# Altium schematic sheet [04] - DOC REVISION HISTORY.SchDoc
size A3; DocumentNumber: 4; SheetNumber: 4; SheetTotal: 4; Organization: Altium Limited; Address1: L3, 12a Rodborough Rd; Address2: Frenchs Forest; Address3: NSW; Address4: Australia 2086
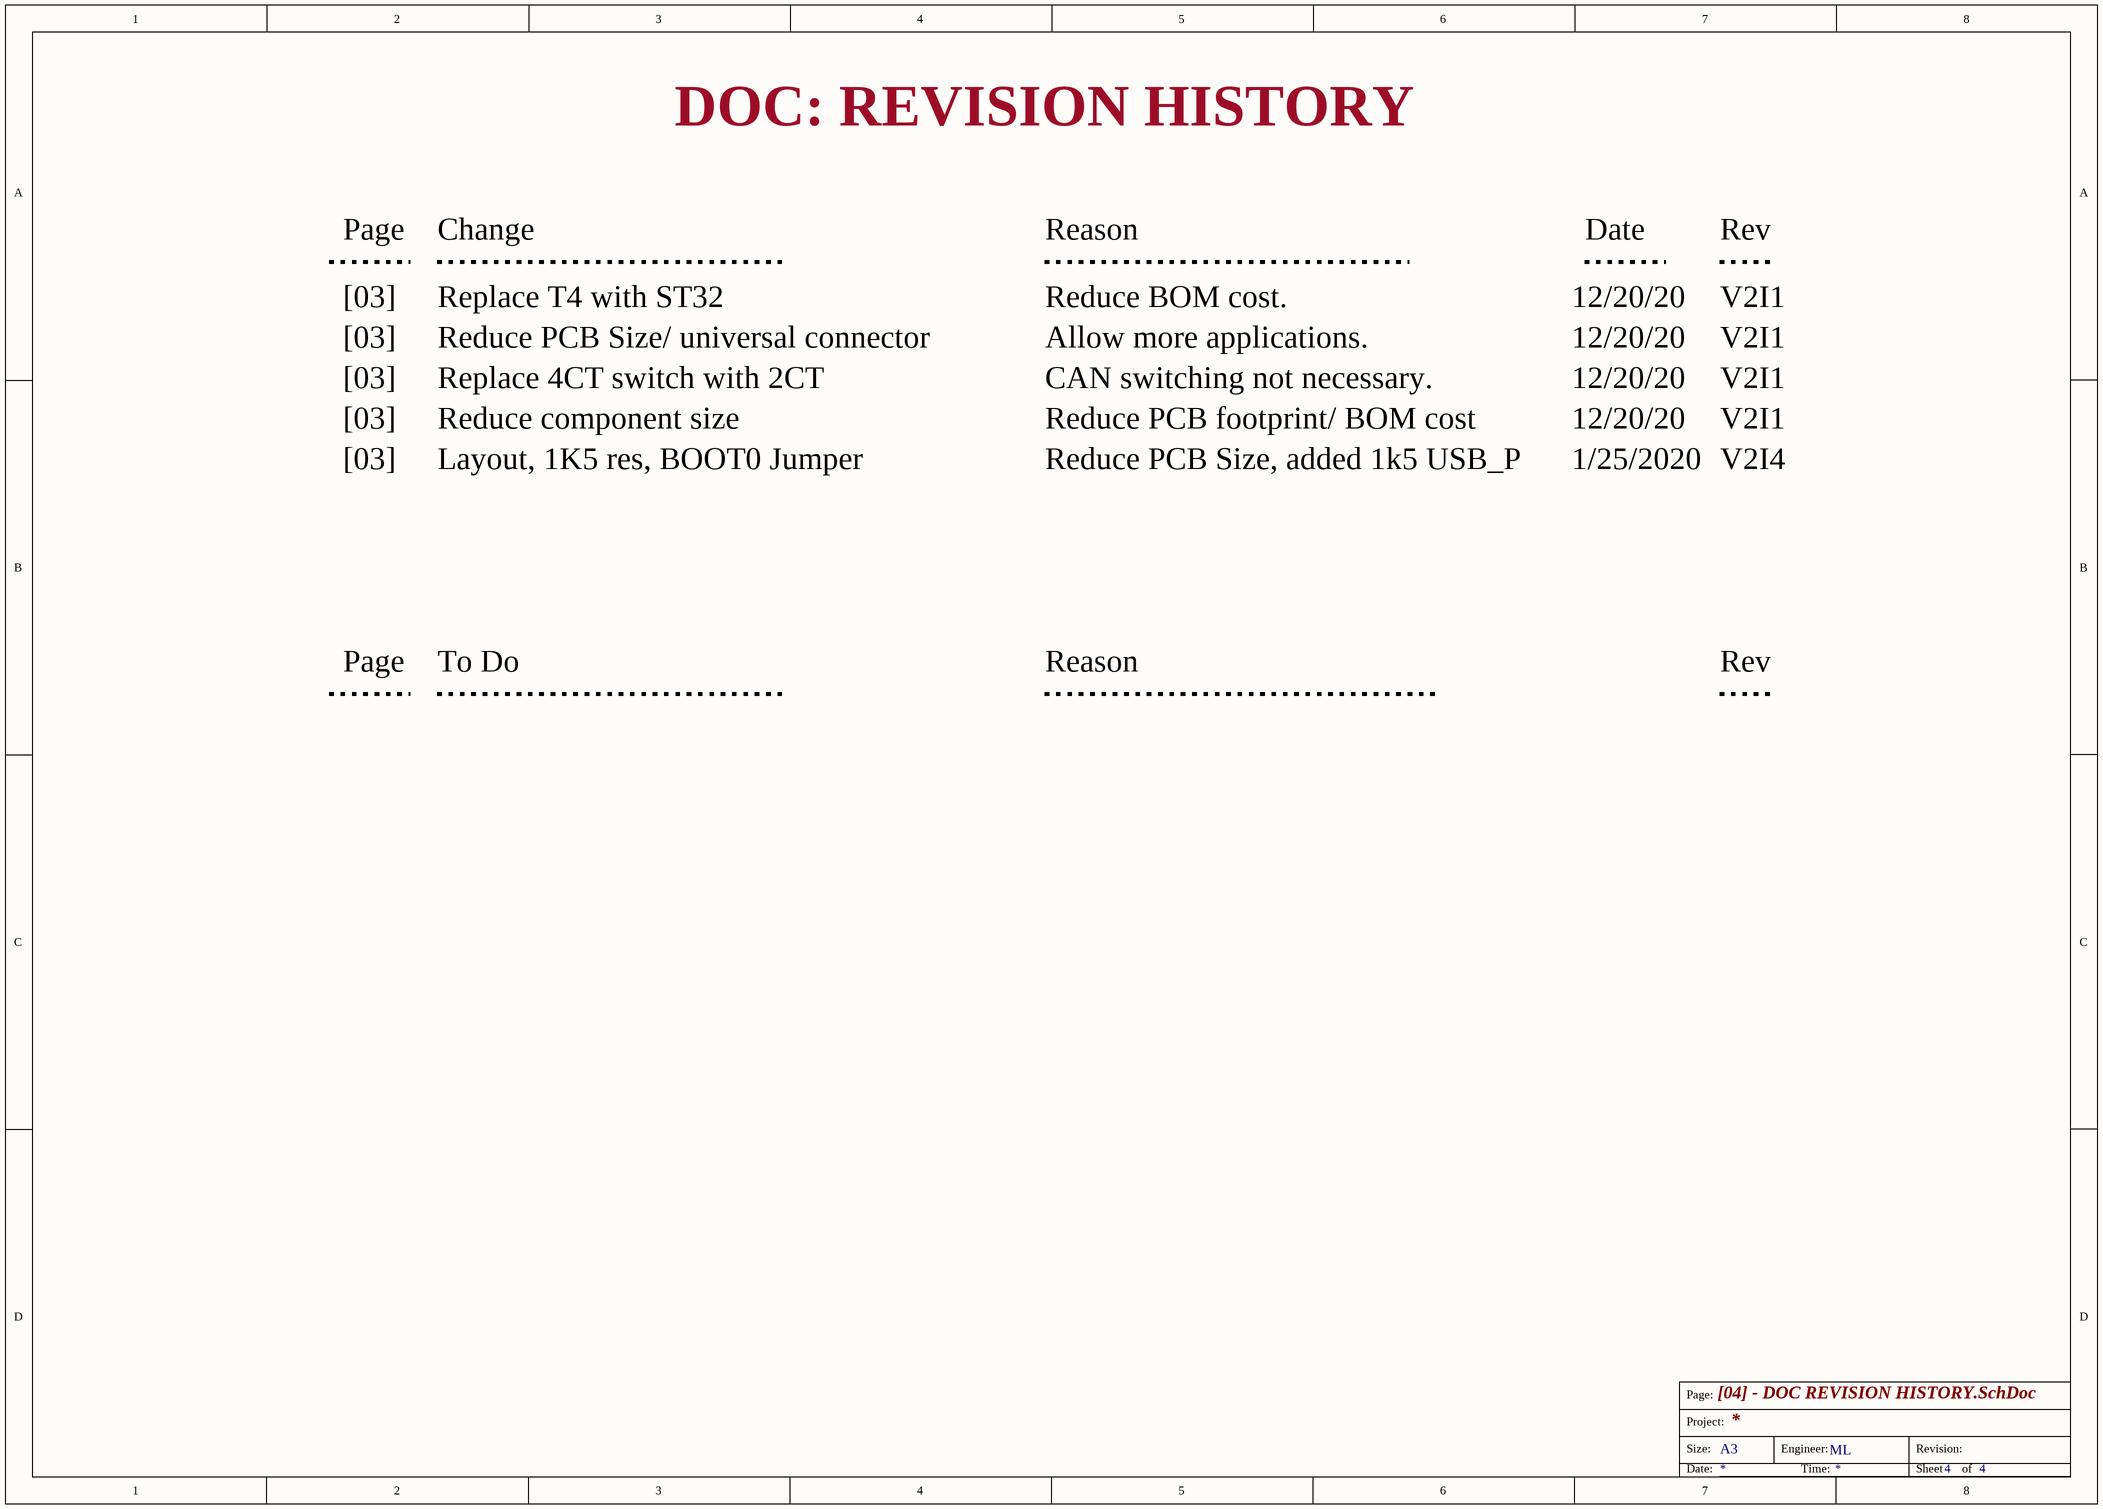
[diagram p0: [04] - DOC REVISION HISTORY.SchDoc]

## Notes on the sheet
- DOC: REVISION HISTORY
- Page
- Change
- Reason
- Date
- Rev
- [03]
- Replace T4 with ST32
- Reduce BOM cost.
- 12/20/20
- V2I1
- Reduce PCB Size/ universal connector
- Allow more applications.
- Replace 4CT switch with 2CT
- Reduce component size
- CAN switching not necessary.
- Reduce PCB footprint/ BOM cost
- Layout, 1K5 res, BOOT0 Jumper
- Reduce PCB Size, added 1k5 USB_P
- 1/25/2020
- V2I4
- To Do
- CLOCKS (CPU & PCIE)
- Page:
- Size:
- Project:
- A3
- Engineer:
- ML
- Revision:
- Date:
- Time:
- Sheet
- of